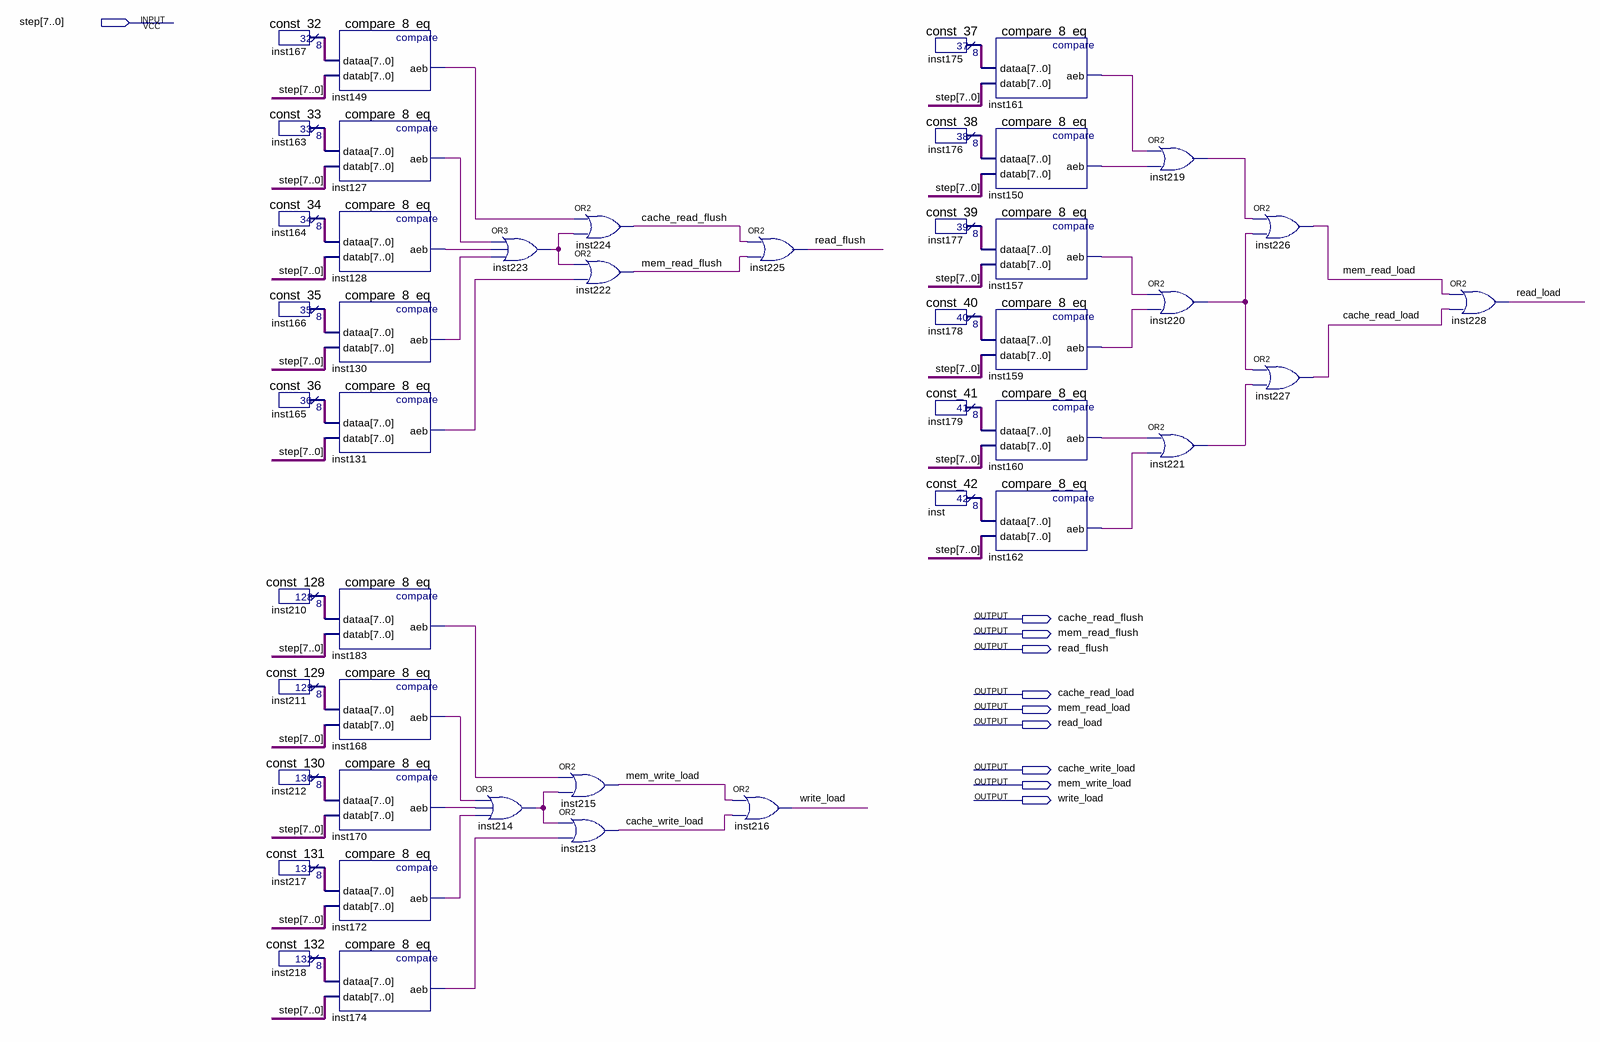
[diagram p0: schematic sheet]
// Quartus schematic load_flush_enable_signals.bdf as structural Verilog: 46 symbols, 10 pins
module load_flush_enable_signals (
  input  [7:0] step,
  output cache_read_flush,
  output mem_read_flush,
  output read_flush,
  output cache_read_load,
  output mem_read_load,
  output read_load,
  output cache_write_load,
  output mem_write_load,
  output write_load
);

  wire inst127_aeb, inst128_aeb, inst130_aeb, inst131_aeb, inst149_aeb, inst150_aeb, inst157_aeb,
       inst159_aeb, inst160_aeb, inst161_aeb, inst162_aeb, inst168_aeb, inst170_aeb, inst172_aeb,
       inst174_aeb, inst183_aeb, inst214_out, inst219_out, inst220_out, inst221_out, inst223_out;
  wire [7:0] inst163_result, inst164_result, inst165_result, inst166_result, inst167_result, inst175_result,
       inst176_result, inst177_result, inst178_result, inst179_result, inst210_result, inst211_result,
       inst212_result, inst217_result, inst218_result, inst_result;

  const_32 inst167 (.result(inst167_result));
  const_33 inst163 (.result(inst163_result));
  const_34 inst164 (.result(inst164_result));
  const_35 inst166 (.result(inst166_result));
  const_36 inst165 (.result(inst165_result));
  const_128 inst210 (.result(inst210_result));
  const_129 inst211 (.result(inst211_result));
  const_130 inst212 (.result(inst212_result));
  const_131 inst217 (.result(inst217_result));
  const_132 inst218 (.result(inst218_result));
  compare_8_eq inst149 (.dataa(inst167_result), .datab(step), .aeb(inst149_aeb));
  compare_8_eq inst127 (.dataa(inst163_result), .datab(step), .aeb(inst127_aeb));
  compare_8_eq inst128 (.dataa(inst164_result), .datab(step), .aeb(inst128_aeb));
  compare_8_eq inst130 (.dataa(inst166_result), .datab(step), .aeb(inst130_aeb));
  compare_8_eq inst131 (.dataa(inst165_result), .datab(step), .aeb(inst131_aeb));
  compare_8_eq inst183 (.dataa(inst210_result), .datab(step), .aeb(inst183_aeb));
  compare_8_eq inst168 (.dataa(inst211_result), .datab(step), .aeb(inst168_aeb));
  compare_8_eq inst170 (.dataa(inst212_result), .datab(step), .aeb(inst170_aeb));
  compare_8_eq inst172 (.dataa(inst217_result), .datab(step), .aeb(inst172_aeb));
  compare_8_eq inst174 (.dataa(inst218_result), .datab(step), .aeb(inst174_aeb));
  or inst214 (inst214_out, inst168_aeb, inst170_aeb, inst172_aeb);
  or inst223 (inst223_out, inst127_aeb, inst128_aeb, inst130_aeb);
  or inst224 (cache_read_flush, inst149_aeb, inst223_out);
  or inst222 (mem_read_flush, inst223_out, inst131_aeb);
  or inst215 (mem_write_load, inst183_aeb, inst214_out);
  or inst213 (cache_write_load, inst214_out, inst174_aeb);
  or inst225 (read_flush, cache_read_flush, mem_read_flush);
  or inst216 (write_load, mem_write_load, cache_write_load);
  const_37 inst175 (.result(inst175_result));
  const_38 inst176 (.result(inst176_result));
  const_39 inst177 (.result(inst177_result));
  const_40 inst178 (.result(inst178_result));
  const_41 inst179 (.result(inst179_result));
  const_42 inst (.result(inst_result));
  compare_8_eq inst161 (.dataa(inst175_result), .datab(step), .aeb(inst161_aeb));
  compare_8_eq inst150 (.dataa(inst176_result), .datab(step), .aeb(inst150_aeb));
  compare_8_eq inst157 (.dataa(inst177_result), .datab(step), .aeb(inst157_aeb));
  compare_8_eq inst159 (.dataa(inst178_result), .datab(step), .aeb(inst159_aeb));
  compare_8_eq inst160 (.dataa(inst179_result), .datab(step), .aeb(inst160_aeb));
  compare_8_eq inst162 (.dataa(inst_result), .datab(step), .aeb(inst162_aeb));
  or inst219 (inst219_out, inst161_aeb, inst150_aeb);
  or inst220 (inst220_out, inst157_aeb, inst159_aeb);
  or inst221 (inst221_out, inst160_aeb, inst162_aeb);
  or inst226 (mem_read_load, inst219_out, inst220_out);
  or inst227 (cache_read_load, inst220_out, inst221_out);
  or inst228 (read_load, mem_read_load, cache_read_load);
endmodule
